# EasyEDA Pro project ProPrj_VFD-CLOCK_2024-10-19.epro, schematic Schematic1

## Sheets
1 VFD: Board Name: Board1; Create Date: 2024-04-14; Page Name: VFD; Project Name: VFD-CLOCK; Schematic Name: Schematic1; Update Date: 2024-10-04; Company: 嘉立创EDA; Page Size: A3; Version: V1.0
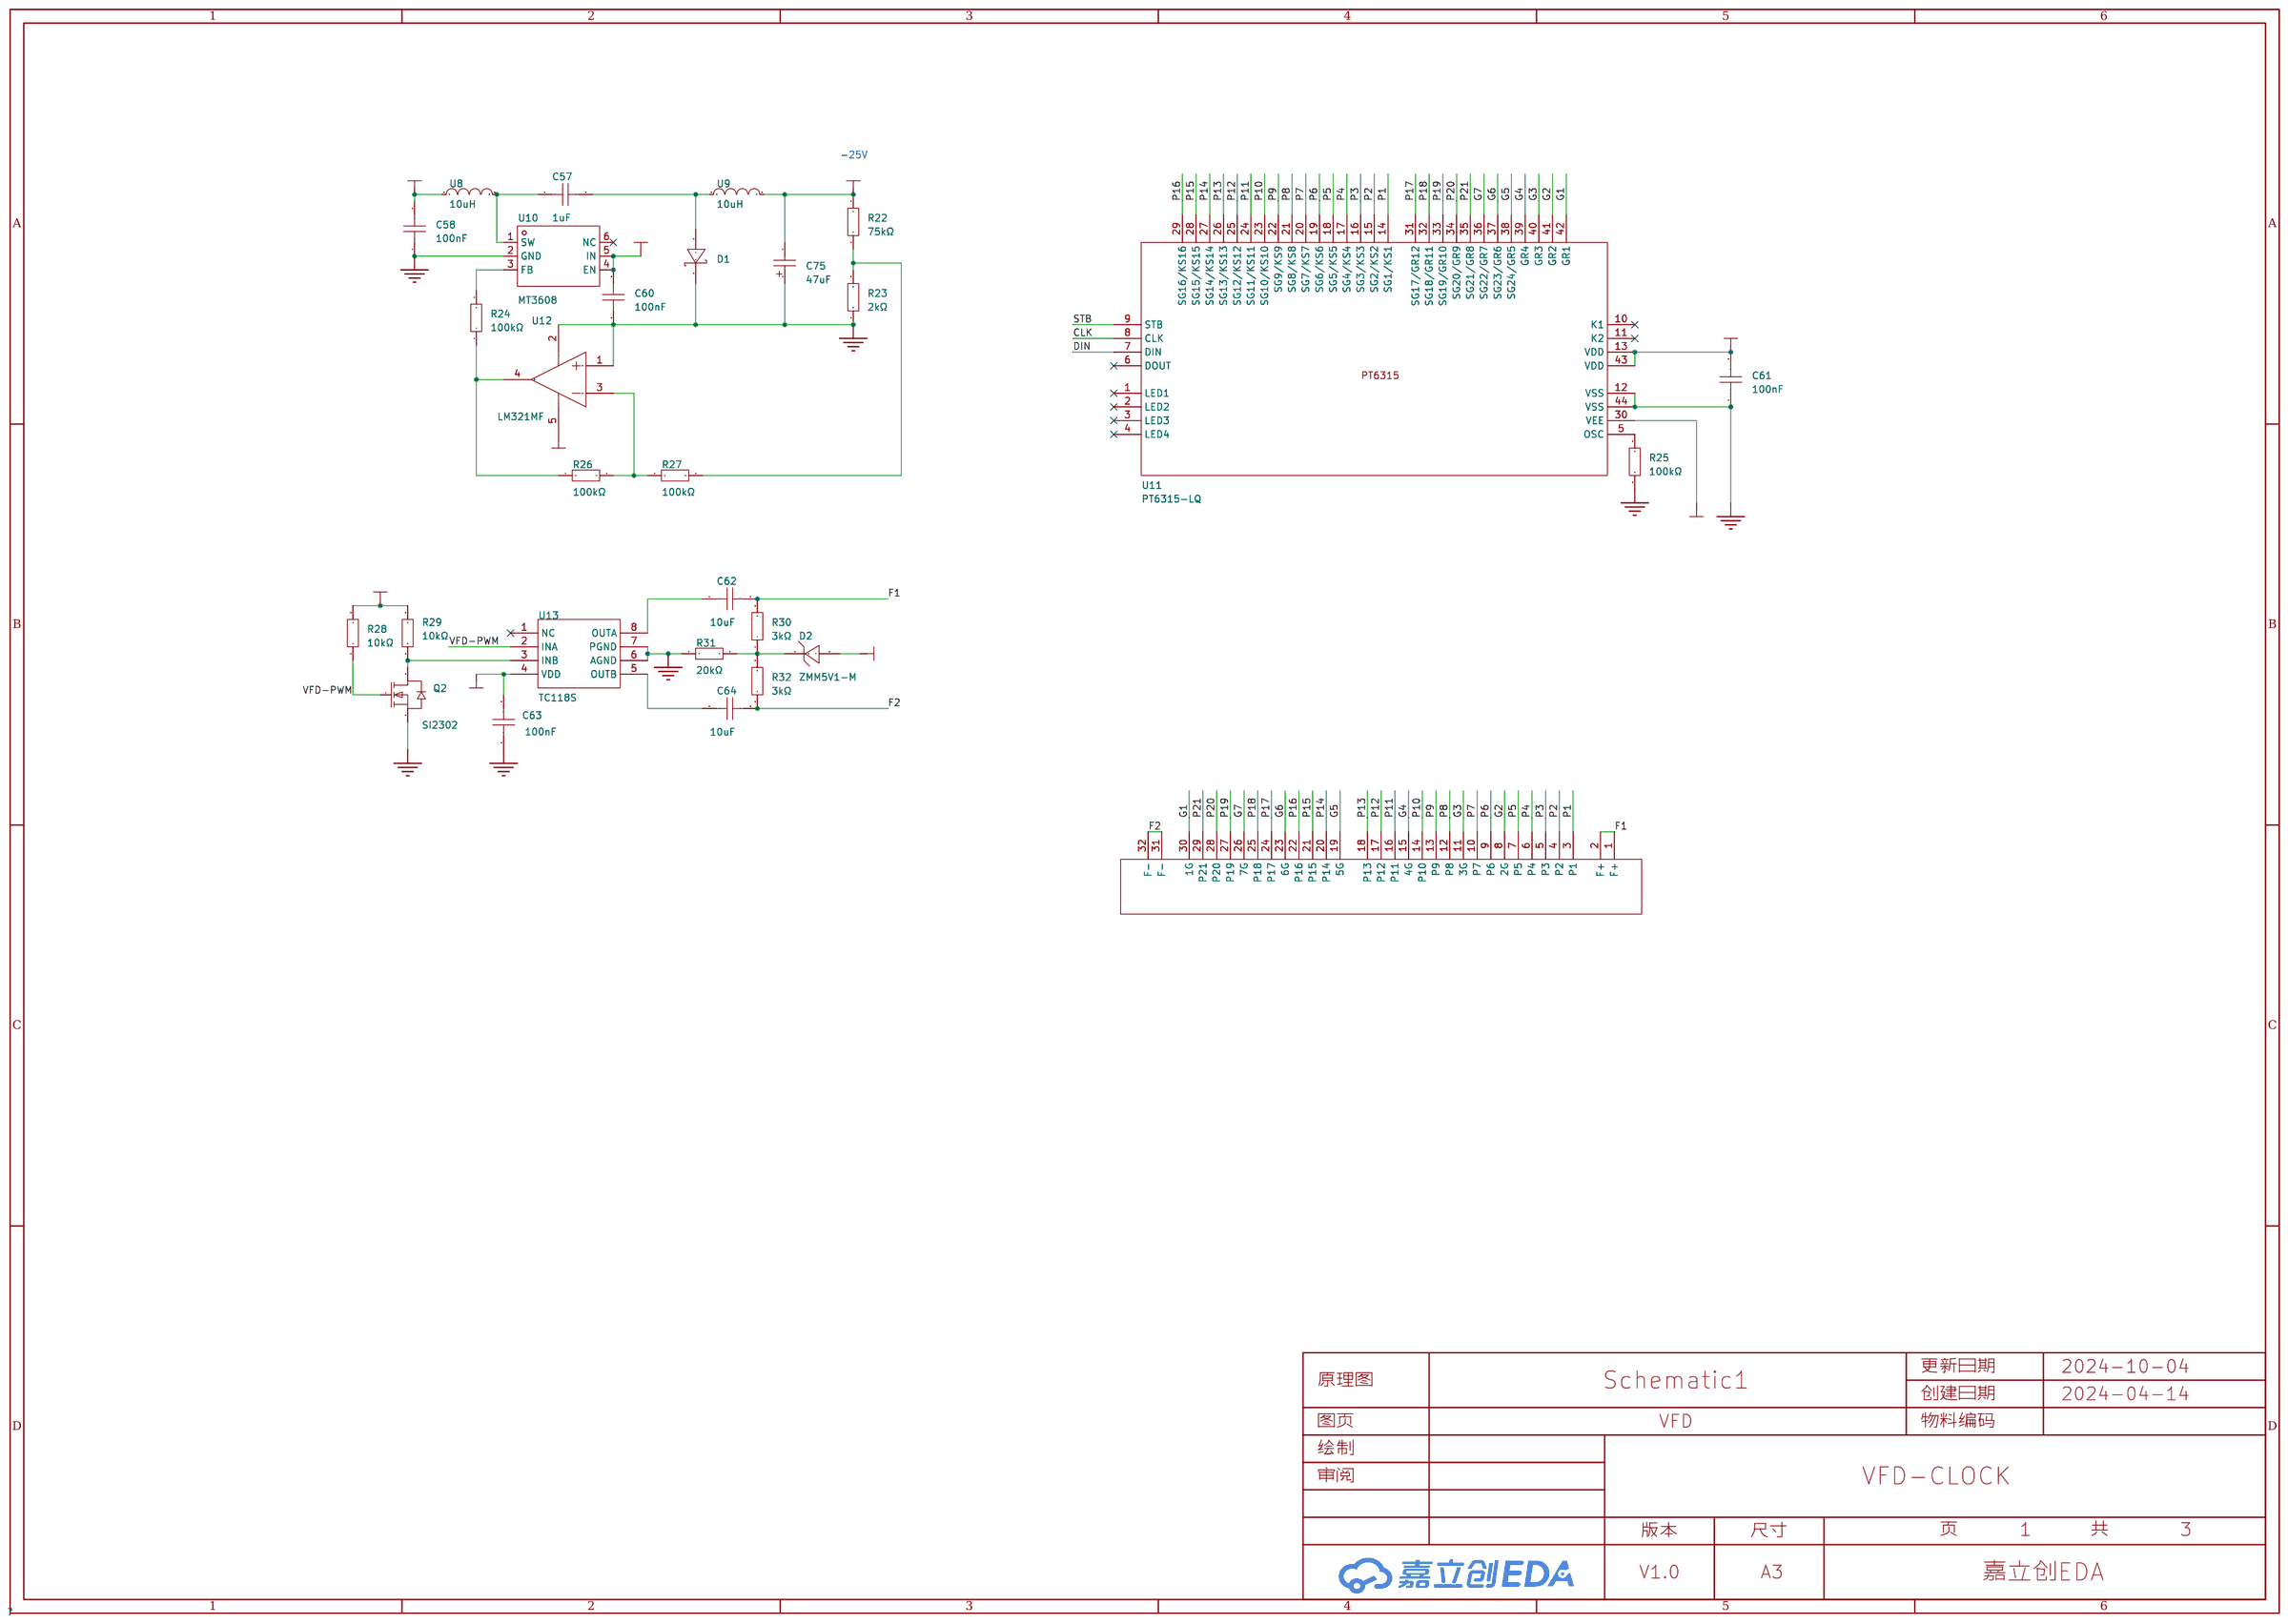
[diagram p1: VFD]
2 MCU: Page Name: MCU; Update Date: 2024-10-16
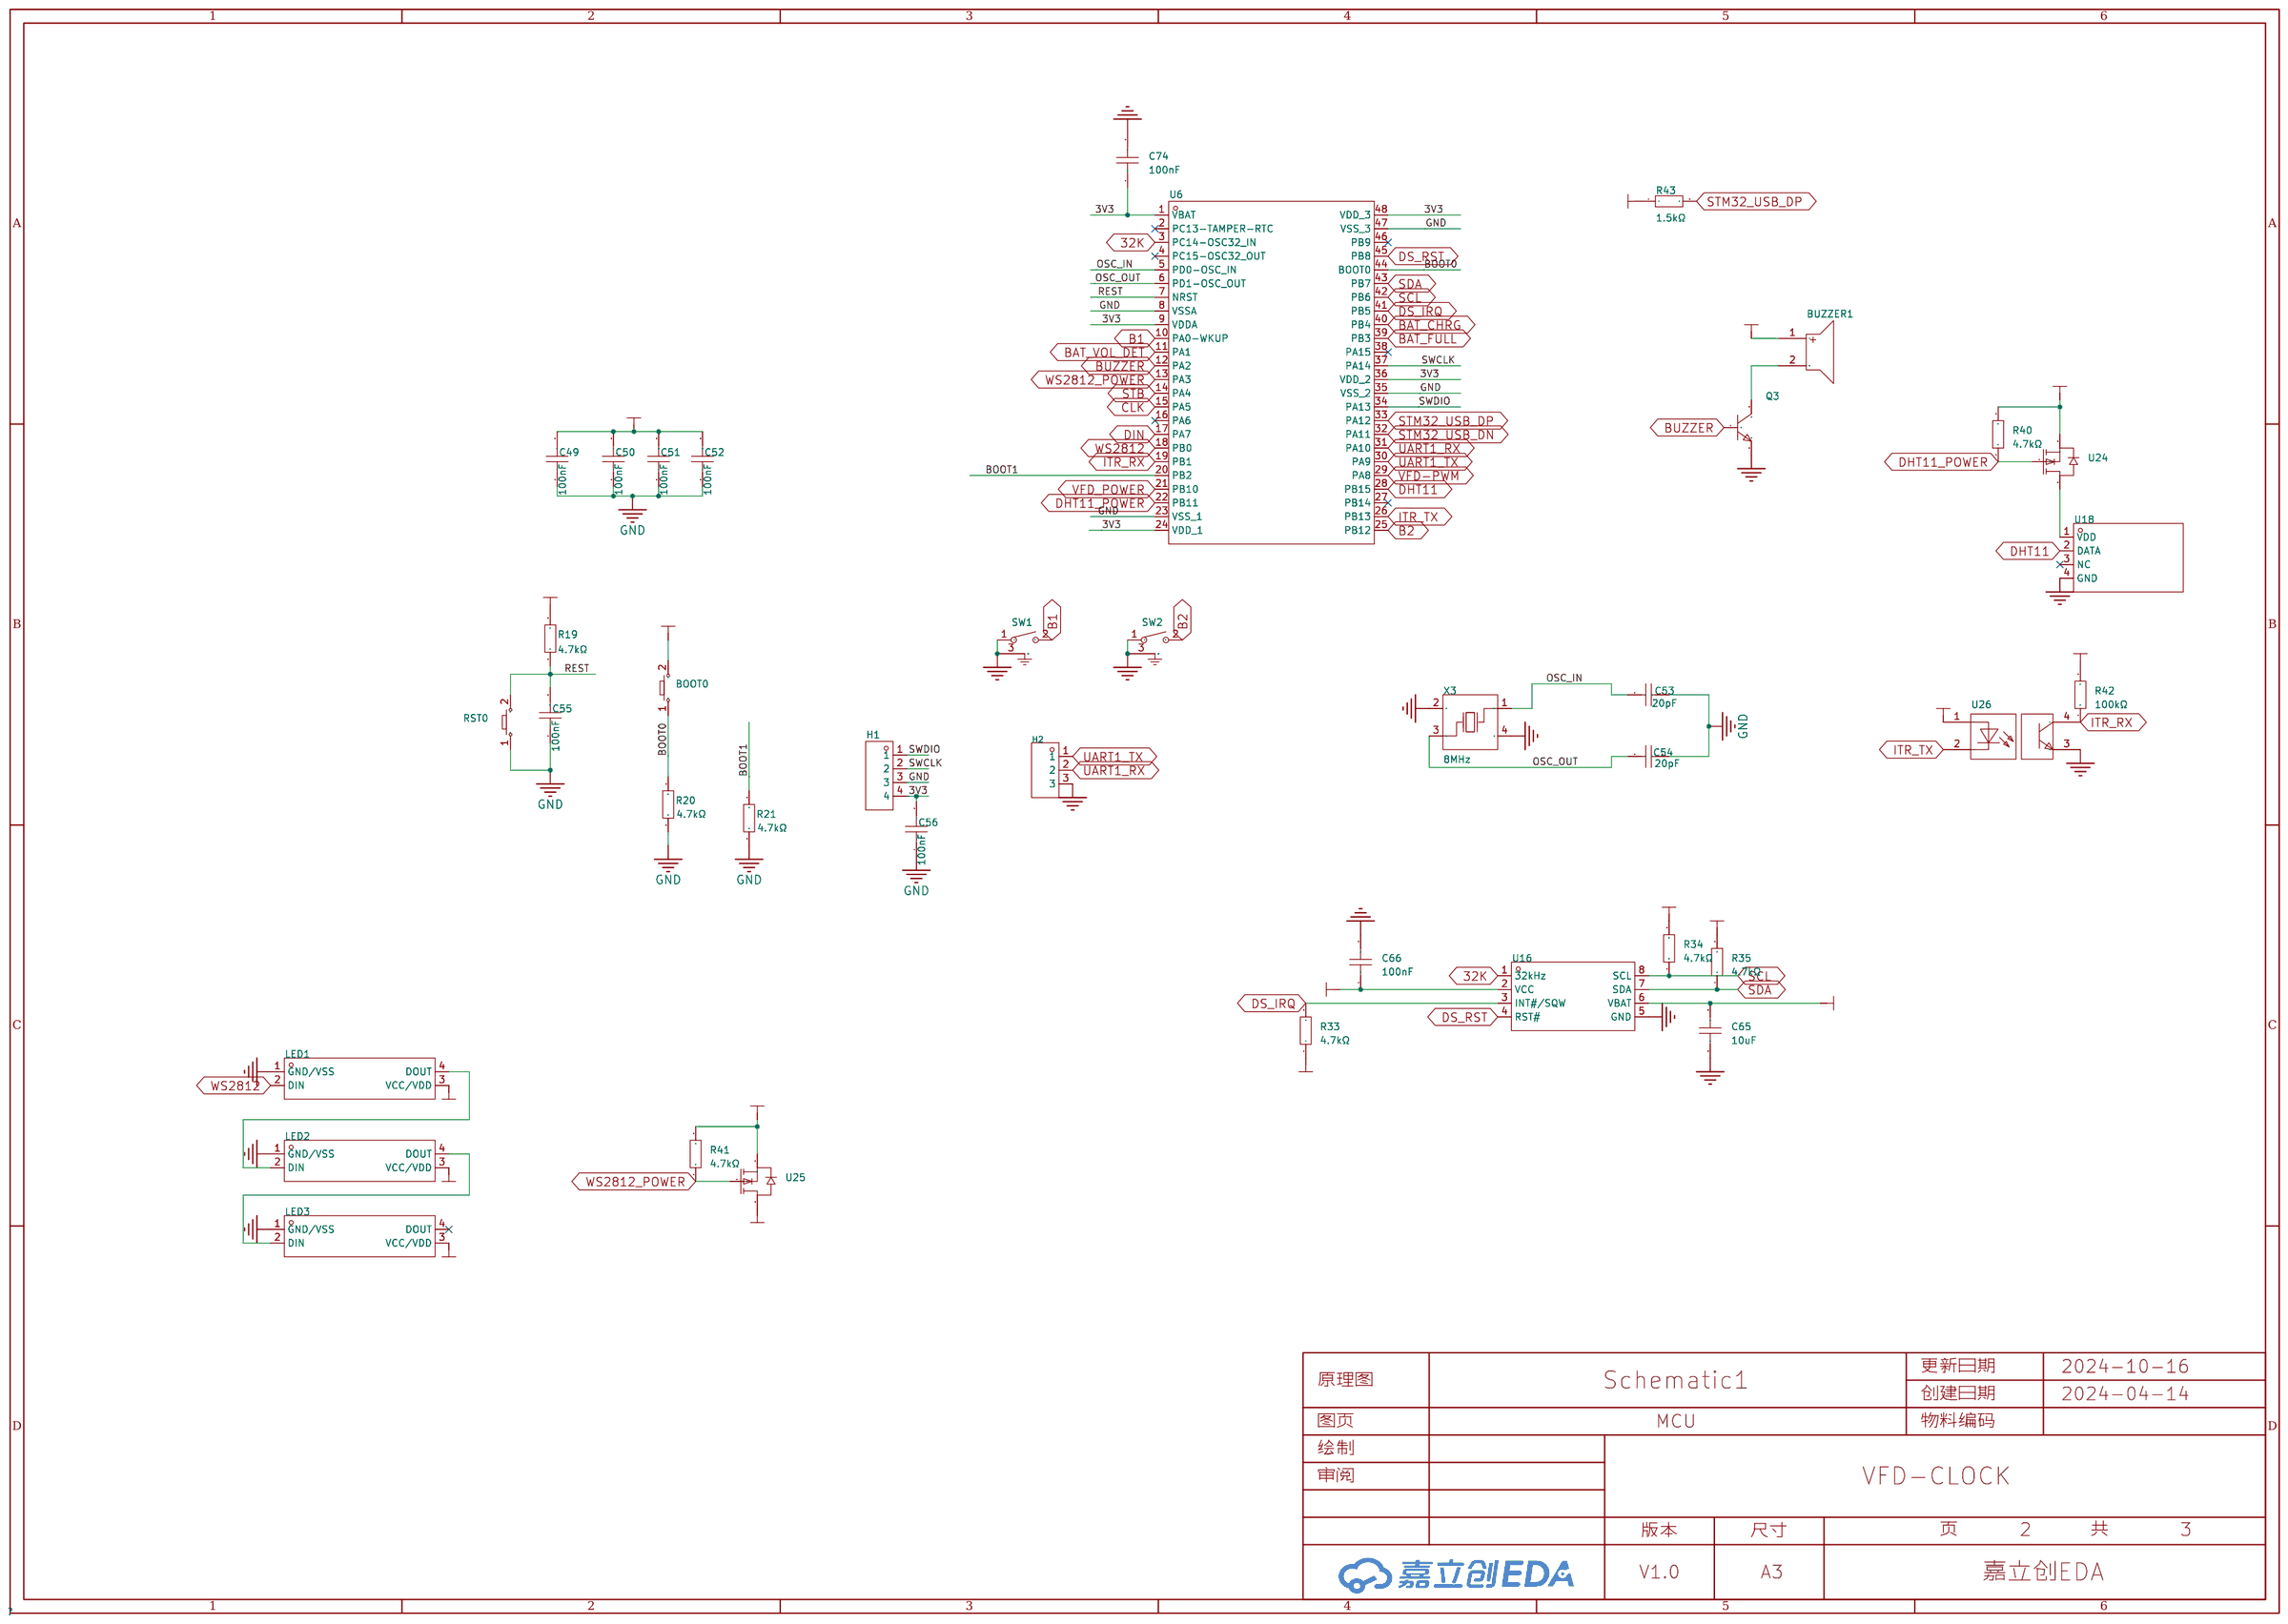
[diagram p2: MCU]
3 POWER: Page Name: POWER; Update Date: 2024-10-16
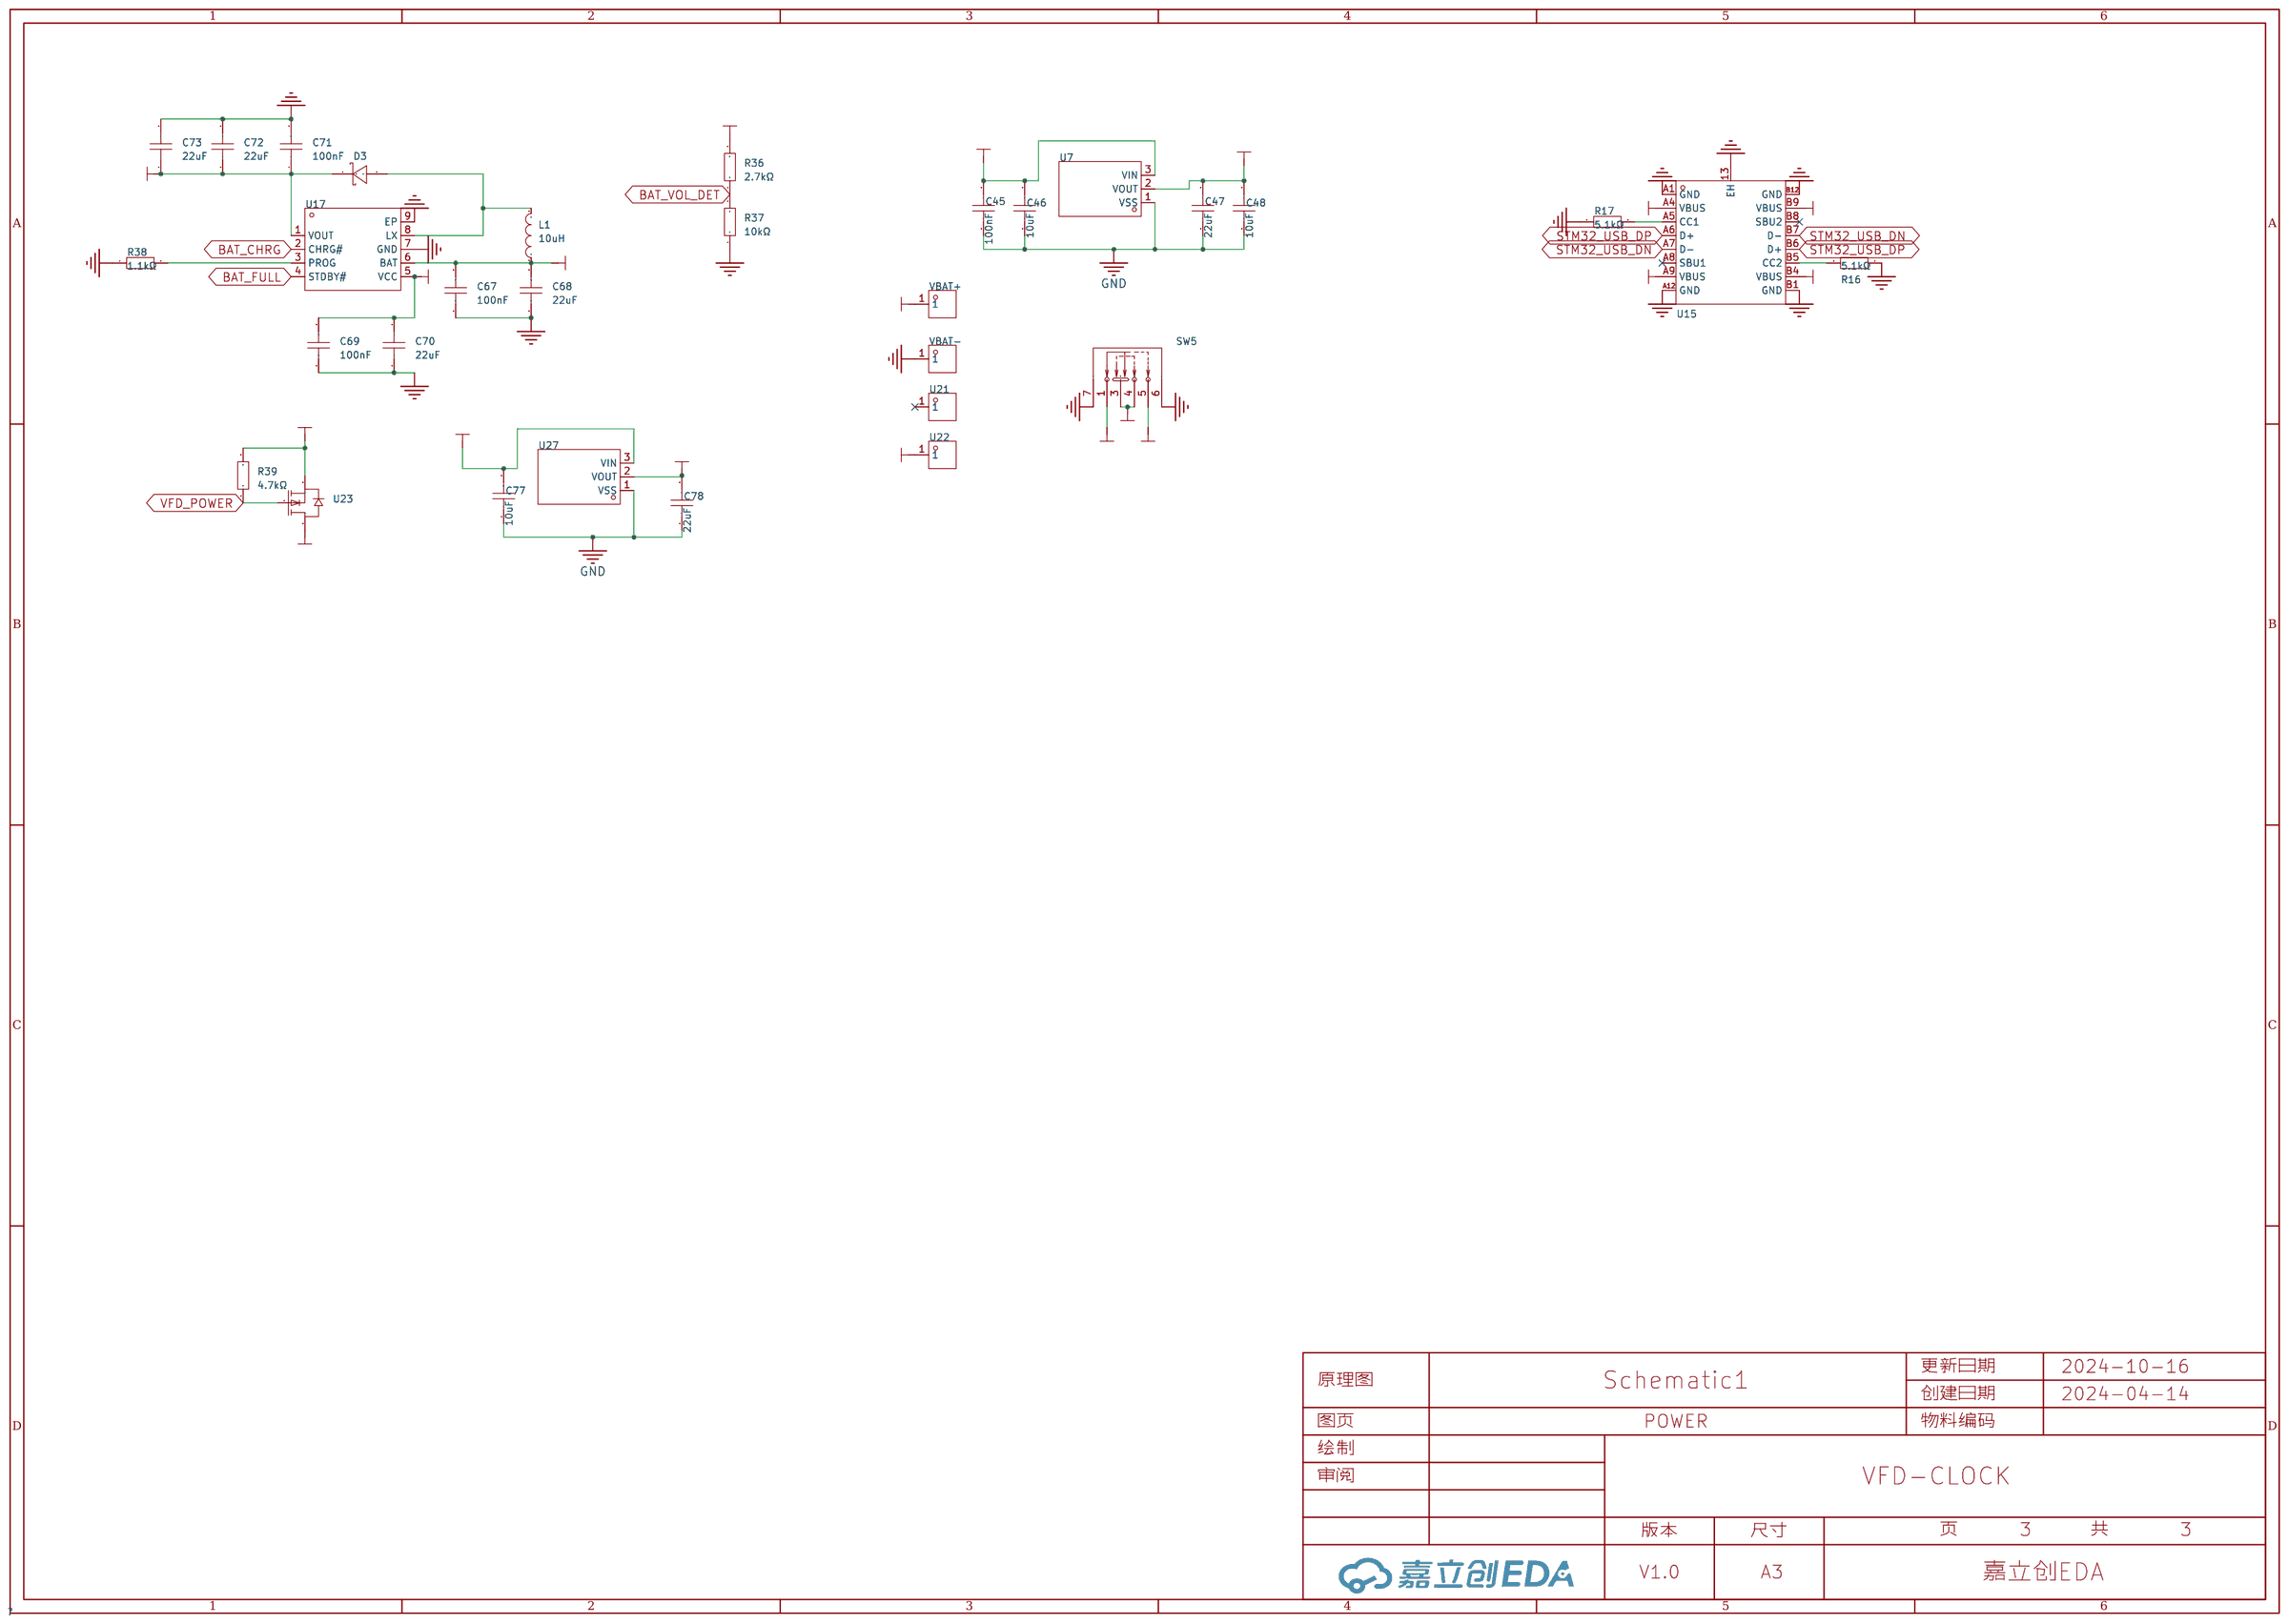
[diagram p3: POWER]

## Parts
sheet MCU
BOOT0  K2-1807SN-A3DW-06  [Key_SMD_3x4x2]
BUZZER1  HX-9042  [BUZ-TH_BD9.0-P4.00-D0.6-FD]
C49  100nF  [C0603]
C50  100nF  [C0603]
C51  100nF  [C0603]
C52  100nF  [C0603]
C53  20pF  [C0603]
C54  20pF  [C0603]
C55  100nF  [C0603]
C56  100nF  [C0603]
C65  10uF  [C0603]
C66  100nF  [C0603]
C74  100nF  [C0603]
H1  -  [HDR-TH_4P-P2.54-V-M]
H2  PZ254V-11-03P  [HDR-TH_3P-P2.54-V-M]
LED1  WS2812B-5050RGB  [LED-SMD_4P-L5.0-W5.0-BR_WS2812B-5050RGB]
LED2  WS2812B-5050RGB  [LED-SMD_4P-L5.0-W5.0-BR_WS2812B-5050RGB]
LED3  WS2812B-5050RGB  [LED-SMD_4P-L5.0-W5.0-BR_WS2812B-5050RGB]
Q3  S8050 J3Y  [SOT-23-3_L3.0-W1.7-P0.95-LS2.9-BR]
R19  4.7kΩ  [R0603]
R20  4.7kΩ  [R0603]
R21  4.7kΩ  [R0603]
R33  4.7kΩ  [R0603]
R34  4.7kΩ  [R0603]
R35  4.7kΩ  [R0603]
R40  4.7kΩ  [R0603]
R41  4.7kΩ  [R0603]
R42  100kΩ  [R0603]
R43  1.5kΩ  [R0603]
RST0  K2-1807SN-A3DW-06  [Key_SMD_3x4x2]
SW1  TS-1038-A10B3-D2  [KEY-TH_TS-1038-A10B3-D2]
SW2  TS-1038-A10B3-D2  [KEY-TH_TS-1038-A10B3-D2]
U6  -  [LQFP-48_L7.0-W7.0-P0.50-LS9.0-BL]
U16  DS3231MZ/V+  [SOIC-8_L4.9-W3.9-P1.27-LS6.0-BL]
U18  DHT11  [SENSOR-TH_DHT11]
U24  AO3401  [SOT-23-3_L2.9-W1.3-P0.95-LS2.4-BR]
U25  AO3401  [SOT-23-3_L2.9-W1.3-P0.95-LS2.4-BR]
U26  ITR20001/T  [OPTO-TH_4P_ITR20001-T-F316]
X3  8MHz  [OSC-SMD_4P-L3.2-W2.5-BL]
sheet POWER
C45  100nF  [C0603]
C46  10uF  [C0603]
C47  22uF  [C0603]
C48  10uF  [C0603]
C67  100nF  [C0603]
C68  22uF  [C0603]
C69  100nF  [C0603]
C70  22uF  [C0603]
C71  100nF  [C0603]
C72  22uF  [C0603]
C73  22uF  [C0603]
C77  10uF  [C0603]
C78  22uF  [C0603]
D3  SS34  [SMA_L4.3-W2.6-LS5.2-RD]
L1  10uH  [IND-SMD_L7.3-W6.6]
R16  5.1kΩ  [R0603]
R17  5.1kΩ  [R0603]
R36  2.7kΩ  [R0603]
R37  10kΩ  [R0603]
R38  1.1kΩ  [R0603]
R39  4.7kΩ  [R0603]
SW5  SK13D07VG4  [SW-TH_SK13D07VG4]
U7  ME6206A33XG  [SOT-23-3_L2.9-W1.6-P1.90-LS2.8-BR]
U15  MC-118LD-H65  [USB-C-TH_HANBO_MC-118LD-H65]
U17  TP5400  [ESOP-8_L4.9-W3.9-P1.27-LS6.0-BL-EP]
U21  M2*10+3六角单通铜  [CONN-TH_C9900012092]
U22  M2*10+3六角单通铜  [CONN-TH_C9900012092]
U23  AO3401  [SOT-23-3_L2.9-W1.3-P0.95-LS2.4-BR]
U27  ME6206A33XG  [SOT-23-3_L2.9-W1.6-P1.90-LS2.8-BR]
VBAT+  M2*10+3六角单通铜  [CONN-TH_C9900012092]
VBAT-  M2*10+3六角单通铜  [CONN-TH_C9900012092]
sheet VFD
C57  1uF  [C0603]
C58  100nF  [C0603]
C60  100nF  [C0603]
C61  100nF  [C0603]
C62  10uF  [C0603]
C63  100nF  [C0603]
C64  10uF  [C0603]
C75  47uF  [C_Ele_SMD_5x5.4mm]
D1  SS34  [SMA_L4.3-W2.6-LS5.2-RD]
D2  ZMM5V1-M  [LL-34_L3.5-W1.5-RD]
Q2  SI2302  [SOT-23-3_L2.9-W1.3-P1.90-LS2.4-BR]
R22  75kΩ  [r0603]
R23  2kΩ  [r0603]
R24  100kΩ  [r0603]
R25  100kΩ  [r0603]
R26  100kΩ  [r0603]
R27  100kΩ  [r0603]
R28  10kΩ  [R0603]
R29  10kΩ  [R0603]
R30  3kΩ  [r0603]
R31  20kΩ  [r0603]
R32  3kΩ  [r0603]
U8  10uH  [IND-SMD_L7.0-W6.6]
U9  10uH  [IND-SMD_L7.0-W6.6]
U10  MT3608  [SOT-23-6_L2.9-W1.6-P0.95-LS2.8-BL]
U11  PT6315-LQ  [LQFP-PT6315]
U12  LM321MF  [SOT-23-5_L2.9-W1.6-P0.95-LS2.8-BR]
U13  TC118S  [SOP-8_L4.9-W3.9-P1.27-LS6.0-BL]
U14  7-BT-317NK  [7-BT-317NK]

## Library data of the parts
BOOT0 RST0 = K2-1807SN-A3DW-06: 作用力:180gf;安装方式:立贴;开关长度:4mm;开关宽度:2.9mm;开关高度:2mm;触点电流:50mA;额定电压(DC):12V;绝缘电阻:100MΩ;机械寿命:10万次;; LCSC Part Name: 3×4×2 160G 2P 无柱 双弹片 防水膜; Supplier Part: C707338; Manufacturer: 韩国韩荣; Supplier Footprint: SMD; JLCPCB Part Class: Extended Part; Datasheet: https://atta.szlcsc.com/upload/public/pdf/source/20210810/47B2303F2A54EA82C8741CE08BEBC5F9.pdf; Supplier: LCSC; Operating Force: 180gf; Mounting Style: 立贴; Switch Length: 4mm; Switch Width: 2.9mm; Switch Height: 2mm; Contact Current: 50mA; Voltage Rating (DC): 12V; Insulation Resistance: 100MΩ; Mechanical Life: 10万次; Operating Temperature: -25℃~+85℃
BUZZER1 = HX-9042: Supplier Part: C9900014398; Supplier Footprint: 9042; JLCPCB Part Class: 扩展库; Supplier: LCSC; Check: true
C45 C47 C49-C52 C55 C56 C78 = CC0603KRX7R9BB104: 容值:100nF;精度:±10%;额定电压:50V;材质(温度系数):X7R;; LCSC Part Name: 100nF ±10% 50V; Supplier Part: C14663; Manufacturer: YAGEO(国巨); Supplier Footprint: 0603; JLCPCB Part Class: Basic Part; Datasheet: https://atta.szlcsc.com/upload/public/pdf/source/20170116/1484561234239.pdf; Supplier: LCSC; Tolerance: ±10%; Voltage Rated: 50V; Temperature Coefficient: X7R
C53 C54 = CL10C200JB8NNNC: 容值:20pF;精度:±5%;额定电压:50V;材质(温度系数):C0G;; LCSC Part Name: 20pF ±5% 50V; Supplier Part: C1648; Manufacturer: SAMSUNG(三星); Supplier Footprint: 0603; JLCPCB Part Class: Basic Part; Datasheet: https://atta.szlcsc.com/upload/public/pdf/source/20160103/1457707686863.pdf; Supplier: LCSC; Tolerance: ±5%; Voltage Rated: 50V; Temperature Coefficient: C0G
C62 C64 C65 = CL10A106KP8NNNC: 容值:10uF;精度:±10%;额定电压:10V;材质(温度系数):X5R;; LCSC Part Name: 10uF ±10% 10V; Supplier Part: C19702; Manufacturer: SAMSUNG(三星); Supplier Footprint: 0603; JLCPCB Part Class: Basic Part; Datasheet: https://atta.szlcsc.com/upload/public/pdf/source/20160218/1457707763339.pdf; Supplier: LCSC; Tolerance: ±10%; Voltage Rated: 10V; Temperature Coefficient: X5R
C58 C60 C61 C63 C66 C67 C69 C71 C74 = CC0603KRX7R9BB104: 容值:100nF;精度:±10%;额定电压:50V;材质(温度系数):X7R;; LCSC Part Name: 100nF ±10% 50V; Supplier Part: C14663; Manufacturer: YAGEO(国巨); Supplier Footprint: 0603; JLCPCB Part Class: Basic Part; Datasheet: https://atta.szlcsc.com/upload/public/pdf/source/20180910/C282072_33301C7F631E79921B82A8DAC6BCC5B3.pdf; Supplier: LCSC; Tolerance: ±10%; Voltage Rated: 50V; Temperature Coefficient: X7R
H1 = PZ254V-11-04P: 间距:2.54mm;总PIN位数:4;排数:1;插针结构:1x4P;行距:-;安装类型:直插;圆针/方针:方针;额定电流:-;额定电压:-;配合针长度:6mm;塑高:2.5mm;端接针长度:3mm;触头材质:黄铜;触头镀层:-;工作温度范围:-40~+105;颜色:黑色;; LCSC Part Name: 2.54mm 1x4P 直插 方针; Supplier Part: C492403; Manufacturer: XFCN(兴飞); Supplier Footprint: 插件,P=2.54mm; JLCPCB Part Class: Extended Part; Datasheet: https://atta.szlcsc.com/upload/public/pdf/source/20200309/C492403_F9F19131791D08044AD4F84F8E751A34.pdf; Supplier: LCSC; Pitch: 2.54mm; Number of Pins: 4; Number of Rows: 1; Pin Structure: 1x4P; Mounting Type: 直插; Circluar Pins/Square Pins: 方针; Length of Mating Pin: 6mm; Insulation Height: 2.5mm; Length of End Connection Pin: 3mm; Contact Material: 黄铜; Operating Temperature Range: -40~+105; Color: 黑色
H2 = PZ254V-11-03P: 插针结构:1x3P;间距:2.54mm;行距:-;圆针/方针:方针;安装类型:直插;排数:单排;总PIN位数:3P;额定电流:3A;额定电压:250V;配合针长度:6mm;塑高:2.5mm;端接针长度:3mm;工作温度范围:-40℃~+105℃;颜色:黑色;; LCSC Part Name: 间距:2.54mm 1x3P 直插 方针; Supplier Part: C2937625; Manufacturer: XFCN(兴飞); Supplier Footprint: 插件,P=2.54mm; JLCPCB Part Class: 扩展库; Datasheet: https://atta.szlcsc.com/upload/public/pdf/source/20200309/C492402_8335C3D49C4E4C618838D59BB1D024C1.pdf; Supplier: LCSC; Pin Structure: 1x3P; Pitch: 2.54mm; Circluar Pins/Square Pins: 方针; Mounting Type: 直插; Number of Rows: 单排; Number of Pins: 3P; Current Rating (Max): 3A; Voltage Rating (Max): 250V; Length of Mating Pin: 6mm; Insulation Height: 2.5mm; Length of End Connection Pin: 3mm; Operating Temperature Range: -40℃~+105℃; Color: 黑色
LED1-LED3 = WS2812B-5050RGB: Supplier Part: C2838584; Supplier Footprint: SMD-4_5.0X5.0X4.2P; JLCPCB Part Class: 扩展库; Supplier: LCSC
Q3 = S8050 J3Y_C2146: 晶体管类型:NPN;集电极电流(Ic):500mA;集射极击穿电压(Vceo):25V;功率(Pd):300mW;直流电流增益(hFE@Ic,Vce):200@50mA,1V;; LCSC Part Name: S8050 J3Y(RANGE:200-350) H档(200-350); Supplier Part: C2146; Manufacturer: CJ(江苏长电/长晶); Supplier Footprint: SOT-23; JLCPCB Part Class: 基础库; Datasheet: https://atta.szlcsc.com/upload/public/pdf/source/20140809/1457707209234.pdf; Supplier: LCSC; Transistor Type: NPN; Collector Current (Ic): 500mA; Collector-Emitter Breakdown Voltage (Vceo): 25V; Power Dissipation (Pd): 300mW; DC Current Gain (hFE@Ic,Vce): 200@50mA,1V; Transition Frequency (fT): 150MHz; Collector Cut-Off Current (Icbo): 100nA; Collector-Emitter Saturation Voltage (VCE(sat)@Ic,Ib): 600mV@500mA,50mA
R19-R21 R33-R35 = 0603WAF4701T5E: 电阻类型:厚膜电阻;阻值:4.7kΩ;精度:±1%;功率:100mW;最大工作电压:75V;温度系数:±100ppm/℃;; LCSC Part Name: 4.7kΩ ±1% 100mW 厚膜电阻; Supplier Part: C23162; Manufacturer: UNI-ROYAL(厚声); Supplier Footprint: 0603; JLCPCB Part Class: Basic Part; Datasheet: https://atta.szlcsc.com/upload/public/pdf/source/20200306/C422600_1E6D84923E4A46A82E41ADD87F860B5C.pdf; Supplier: LCSC; Type: 厚膜电阻; Tolerance: ±1%; Power(Watts): 100mW; Overload Voltage (Max): 75V; Temperature Coefficient: ±100ppm/℃; Operating Temperature Range: -55℃~+155℃
R28 R29 R37 R39-R41 = 0603WAF1002T5E: 电阻类型:厚膜电阻;阻值:10kΩ;精度:±1%;功率:100mW;最大工作电压:75V;温度系数:±100ppm/℃;; LCSC Part Name: 厚膜电阻 10kΩ ±1% 100mW; Supplier Part: C25804; Manufacturer: UNI-ROYAL(厚声); Supplier Footprint: 0603; JLCPCB Part Class: Basic Part; Datasheet: https://atta.szlcsc.com/upload/public/pdf/source/20200306/C422600_1E6D84923E4A46A82E41ADD87F860B5C.pdf; Supplier: LCSC; Type: 厚膜电阻; Tolerance: ±1%; Power(Watts): 100mW; Overload Voltage (Max): 75V; Temperature Coefficient: ±100ppm/℃; Operating Temperature Range: -55℃~+155℃
R24-R27 R42 = 0603WAF1003T5E: 电阻类型:厚膜电阻;阻值:100kΩ;精度:±1%;功率:100mW;最大工作电压:75V;温度系数:±100ppm/℃;; LCSC Part Name: 100kΩ ±1% 100mW 厚膜电阻; Supplier Part: C25803; Manufacturer: UNI-ROYAL(厚声); Supplier Footprint: 0603; JLCPCB Part Class: Basic Part; Datasheet: https://atta.szlcsc.com/upload/public/pdf/source/20200306/C422600_1E6D84923E4A46A82E41ADD87F860B5C.pdf; Supplier: LCSC; Type: 厚膜电阻; Tolerance: ±1%; Power(Watts): 100mW; Overload Voltage (Max): 75V; Temperature Coefficient: ±100ppm/℃; Operating Temperature Range: -55℃~+155℃
R43 = Res_0603: Supplier Footprint: 0603
SW1 SW2 = TS-1038-A10B3-D2: 电路结构:单刀单掷;按钮形状:圆形按钮;作用力:250gf;安装方式:卧插;开关高度:8.5mm;带支架:带支架;机械寿命:-;; LCSC Part Name: 轻触开关6*6*8.5插件带支架按键四脚侧按250gf; Supplier Part: C499341; Manufacturer: Yuandi(元迪); Supplier Footprint: 插件; JLCPCB Part Class: 扩展库; Datasheet: https://atta.szlcsc.com/upload/public/pdf/source/20200318/C499335_4B4A7BCFD69E5F6CF6B720C838D8CF83.pdf; Supplier: LCSC; Circuit: 单刀单掷; Actuator Style: 圆形按钮; Operating Force: 250gf; Mounting Style: 卧插; Switch Height: 8.5mm; Strike Gundam: 带支架; Actuator/Cap Color: 黑色; Pin Style: PC引脚
U6 = STM32F103C8T6: CPU位数:32-Bit;ROM类型:FLASH;CPU内核:ARM® Cortex®-M3;主频（MAX):72MHz;工作电压:2V ~ 3.6V;; LCSC Part Name: STM32F103C8T6 MSL=3; Supplier Part: C8734; Manufacturer: ST(意法半导体); Supplier Footprint: LQFP-48_7x7x05P; JLCPCB Part Class: Basic Part; Datasheet: https://atta.szlcsc.com/upload/public/pdf/source/20140724/1457707174202.pdf; Supplier: LCSC; Core Size: 32-Bit; Program Memory Type: FLASH; Core Processor: ARM® Cortex®-M3; Speed: 72MHz; Voltage - Supply (Vcc/Vdd): 2V ~ 3.6V; Program Memory Size: 64KB; RAM Size: 20KB; Number of I/O: 37; A/D: 10x12bit; D/A: 0; PWM: 13; LCD: 0; UART/USART: 3 USART; SPI: 2; I2C（SMBUS/PMBUS）: 2; USB Device: 1; CAN: 1; Ethernet: 0
U16 = DS3231MZ/V+: 接口:I2C;; Supplier Part: C3304431; Manufacturer: ADI(亚德诺)/MAXIM(美信); Supplier Footprint: SOIC-8; JLCPCB Part Class: 扩展库; Datasheet: https://atta.szlcsc.com/upload/public/pdf/source/20170620/1497944726830.pdf; Supplier: LCSC; Interface: I2C; Operating Voltage: 2.3V~5.5V; Operating Temperature: -40℃~+85℃
U18 = DHT11: 新款电容式数字温湿度传感器,老款已停产16.1x12.6x5.8mm; LCSC Part Name: DHT11  电容式传感器; Supplier Part: C117051; Manufacturer: 广州奥松; Supplier Footprint: SIP-4; JLCPCB Part Class: 扩展库; Datasheet: https://atta.szlcsc.com/upload/public/pdf/source/20170703/1499081238365.pdf; Supplier: LCSC
U23-U25 = AO3401_C5299438: Supplier Part: C5299438; Manufacturer: DOWO(东沃); Supplier Footprint: SOT-23; JLCPCB Part Class: 扩展库; Datasheet: https://atta.szlcsc.com/upload/public/pdf/source/20230921/ED7DEAEFE7908930CD835A6C8952C5E1.pdf; Supplier: LCSC
U26 = ITR20001/T: 感应距离:5mm;集电极电流(最大值):20mA;; Supplier Part: C264269; Manufacturer: EVERLIGHT(亿光); Supplier Footprint: DIP-4; JLCPCB Part Class: 扩展库; Datasheet: https://atta.szlcsc.com/upload/public/pdf/source/20180817/C264269_4256B5400489B2A8B2B17FEF85C63C6F.pdf; Supplier: LCSC; Sensing Distance: 5mm; Collector Current (Max): 20mA
X3 = TAXM8M4RDBCCT2T: 晶振类型:贴片晶振;频率:8MHz;常温频差:±10ppm;外接负载电容:10pF;频率稳定度(全温):±15ppm;; LCSC Part Name: 8MHz ±10ppm 10pF; Supplier Part: C400090; Manufacturer: YJX(雅晶鑫); Supplier Footprint: SMD3225-4P; JLCPCB Part Class: Extended Part; Datasheet: https://atta.szlcsc.com/upload/public/pdf/source/20190626/C400090_CF95B89E745AFE4EF2E392EF8AC009D6.pdf; Supplier: LCSC; Crystal Type: 贴片晶振; Normal temperature Frequency Tolerance: ±10ppm; External load capacitor: 10pF; Frequency Stability(Full temperature range): ±15ppm; Equivalent Series Resistance (ESR): 250Ω; Operating Temperature: -40℃~+85℃
C46 C48 C77 = CL10A106KP8NNNC: 容值:10uF;精度:±10%;额定电压:10V;材质(温度系数):X5R;; LCSC Part Name: 10uF ±10% 10V; Supplier Part: C19702; Manufacturer: SAMSUNG(三星); Supplier Footprint: 0603; JLCPCB Part Class: Basic Part; Datasheet: https://atta.szlcsc.com/upload/public/pdf/source/20160103/1457707703378.pdf; Supplier: LCSC; Tolerance: ±10%; Voltage Rated: 10V; Temperature Coefficient: X5R
C68 C70 C72 C73 = CGA0603X5R226M160JT: 容值:22uF;精度:±20%;额定电压:16V;材质(温度系数):X5R;; LCSC Part Name: 22uF ±20% 16V; Supplier Part: C6119868; Manufacturer: HRE(芯声); Supplier Footprint: 0603; JLCPCB Part Class: Extended Part; Supplier: LCSC; Tolerance: ±20%; Voltage Rated: 16V; Temperature Coefficient: X5R
D1 D3 = SS34_C8678: 二极管配置:独立式;正向压降(Vf):550mV@3A;直流反向耐压(Vr):40V;整流电流:3A;; LCSC Part Name: 电压:40V 电流:3A; Supplier Part: C8678; Manufacturer: MDD(辰达半导体); Supplier Footprint: SMA(DO-214AC); JLCPCB Part Class: Basic Part; Datasheet: https://atta.szlcsc.com/upload/public/pdf/source/20230314/A80AE34493C69B89E2F4B1712F433538.pdf; Supplier: LCSC; Diode Configuration: 独立式; Forward Voltage (Vf@If): 550mV@3A; Reverse Voltage (Vr): 40V; Average Rectified Current (Io): 3A; Reverse Leakage Current (Ir): 500uA@40V; Rectified Current: 3A
L1 = MCS0630-100MPY1: 电感值:10uH;精度:±20%;额定电流:4A;饱和电流(Isat):5.5A;; LCSC Part Name: 10uH ±20% 5.5A; Supplier Part: C2937094; Manufacturer: PSA(信昌电陶); Supplier Footprint: 0630; JLCPCB Part Class: 扩展库; Datasheet: https://atta.szlcsc.com/upload/public/pdf/source/20220121/EA6E6E6F70ED7BAE67EC293805EAAACB.pdf; Supplier: LCSC; Tolerance: ±20%; Rated Current: 4A; Saturation Current (Isat): 5.5A; DC Resistance (DCR): 62mΩ
R16 R17 = 0603WAF5101T5E: 电阻类型:厚膜电阻;阻值:5.1kΩ;精度:±1%;功率:100mW;最大工作电压:75V;温度系数:±100ppm/℃;; LCSC Part Name: 5.1kΩ ±1% 100mW 厚膜电阻; Supplier Part: C23186; Manufacturer: UNI-ROYAL(厚声); Supplier Footprint: 0603; JLCPCB Part Class: Basic Part; Datasheet: https://atta.szlcsc.com/upload/public/pdf/source/20200306/C422600_1E6D84923E4A46A82E41ADD87F860B5C.pdf; Supplier: LCSC; Type: 厚膜电阻; Tolerance: ±1%; Power(Watts): 100mW; Overload Voltage (Max): 75V; Temperature Coefficient: ±100ppm/℃; Operating Temperature Range: -55℃~+155℃
R36 = 0603WAF2701T5E: 电阻类型:厚膜电阻;阻值:2.7kΩ;精度:±1%;功率:100mW;最大工作电压:75V;温度系数:±100ppm/℃;; LCSC Part Name: 2.7kΩ ±1% 100mW 厚膜电阻; Supplier Part: C13167; Manufacturer: UNI-ROYAL(厚声); Supplier Footprint: 0603; JLCPCB Part Class: Basic Part; Datasheet: https://atta.szlcsc.com/upload/public/pdf/source/20200306/C422600_1E6D84923E4A46A82E41ADD87F860B5C.pdf; Supplier: LCSC; Type: 厚膜电阻; Tolerance: ±1%; Power(Watts): 100mW; Overload Voltage (Max): 75V; Temperature Coefficient: ±100ppm/℃; Operating Temperature Range: -55℃~+155℃
R38 = 0603WAF1101T5E: 电阻类型:厚膜电阻;阻值:1.1kΩ;精度:±1%;功率:100mW;最大工作电压:75V;温度系数:±100ppm/℃;; LCSC Part Name: 1.1kΩ ±1% 100mW 厚膜电阻; Supplier Part: C22764; Manufacturer: UNI-ROYAL(厚声); Supplier Footprint: 0603; JLCPCB Part Class: Extended Part; Datasheet: https://atta.szlcsc.com/upload/public/pdf/source/20200306/C422600_1E6D84923E4A46A82E41ADD87F860B5C.pdf; Supplier: LCSC; Type: 厚膜电阻; Tolerance: ±1%; Power(Watts): 100mW; Overload Voltage (Max): 75V; Temperature Coefficient: ±100ppm/℃; Operating Temperature Range: -55℃~+155℃
SW5 = SK13D07VG4: 电路结构:单刀三掷;安装方式:侧插;开关颜色:-;额定电流(DC):300mA;额定电压(DC):50V;额定电流(AC):-;额定电压(AC):-;机械寿命:5千次;; LCSC Part Name: 4脚3三档位SK13D07VG2 1P3T卧式拨动开关,柄长4MM; Supplier Part: C2681581; Manufacturer: SHOU HAN(首韩); Supplier Footprint: 插件; JLCPCB Part Class: 扩展库; Datasheet: https://atta.szlcsc.com/upload/public/pdf/source/20210224/C2681581_976B40BF7B723A53FF2B4716D1A8276E.pdf; Supplier: LCSC; Circuit: 单刀三掷; Pin Style: PC引脚; Switch Length: 12.6mm; Switch Width: 4.4mm; Switch Height: 4.7mm; Mounting Style: 侧插; Current Rating (DC): 300mA; Voltage Rating (DC): 50V; Mechanical Life: 5千次; Operating Temperature: -10℃~+50℃
U7 U27 = ME6206A33XG: 输出类型:固定;输出极性:正;最大输入电压:6V;输出电压:3.3V;输出电流:300mA;电源纹波抑制比(PSRR):50dB@(1kHz);; LCSC Part Name: 输入6V 输出3.3V 300mA; Supplier Part: C161345; Manufacturer: MICRONE(南京微盟); Supplier Footprint: SOT-23; JLCPCB Part Class: 扩展库; Datasheet: https://atta.szlcsc.com/upload/public/pdf/source/20180207/C161345_15179949863651359188.pdf; Supplier: LCSC; Output Type: 固定; Output Polarity: 正; Number of Outputs: 1; Maximum Input Voltage: 6V; Output Voltage: 3.3V; Dropout Voltage: 400mV@(200mA); Output Current: 300mA; Power Supply Rejection Ratio (PSRR): 50dB@(1kHz)
U15 = MC-118LD-H65: 连接器类型:Type-C;标准:USB 3.1;公母:母;端口数量:1;触点数量:16P;安装方式:直插;额定电流 - 电源:5A;工作温度范围:-55℃~+85℃;焊接温度(最大值):260℃;; LCSC Part Name: Type-C 母 直插; Supplier Part: C6332304; Manufacturer: HANBO(汉博); Supplier Footprint: 插件; JLCPCB Part Class: 扩展库; Datasheet: https://atta.szlcsc.com/upload/public/pdf/source/20230512/493F86F6440C2CBC9B0BB9A42FADB62F.pdf; Supplier: LCSC; Connector Type: Type-C; Standard: USB 3.1; Gender: 母; Number of Ports: 1; Number of Contacts: 16P; Mounting Style: 直插; Current Rating - Power (Max): 5A; Operating Temperature Range: -55℃~+85℃; Soldering Temperature(Max): 260℃
U17 = TP5400: Supplier Part: C2891434; Manufacturer: TOPPOWER(南京拓微); Supplier Footprint: ESOP-8; JLCPCB Part Class: 扩展库; Datasheet: https://atta.szlcsc.com/upload/public/pdf/source/20210909/352D9D40D77A1DD73F7904E364EF004B.pdf; Supplier: LCSC
U21 U22 VBAT+ VBAT- = M2*10+3六角单通铜: Supplier Part: C9900012092; JLCPCB Part Class: 扩展库; Supplier: LCSC
C57 = CL10A105KB8NNNC: 容值:1uF;精度:±10%;额定电压:50V;材质(温度系数):X5R;; LCSC Part Name: 1uF ±10% 50V; Supplier Part: C15849; Manufacturer: SAMSUNG(三星); Supplier Footprint: 0603; JLCPCB Part Class: Basic Part; Datasheet: https://atta.szlcsc.com/upload/public/pdf/source/20160218/1457707763339.pdf; Supplier: LCSC; Tolerance: ±10%; Voltage Rated: 50V; Temperature Coefficient: X5R
C75 = RST47UF25V035: 容值:47uF;精度:±20%;额定电压:25V;纹波电流:46mA@120Hz;等效串联电阻:-;; LCSC Part Name: 47uF ±20% 25V; Supplier Part: C4747958; Manufacturer: KNSCHA(科尼盛); Supplier Footprint: SMD,D5xL5.4mm; JLCPCB Part Class: Extended Part; Datasheet: https://atta.szlcsc.com/upload/public/pdf/source/20220722/F8BC83B31678FEDC3CD0A31DD9384B2B.pdf; Supplier: LCSC; Tolerance: ±20%; Rated Voltage: 25V; Ripple Current: 46mA@120Hz; φD: 5mm; L: 5.4mm; Lifetime @ Temp: 2000hrs@105℃; Operating Temperature: -40℃~+105℃
D2 = ZMM5V1-M: 二极管配置:独立式;稳压值(标称值):5.1V;稳压值(范围):4.8V~5.4V;精度:-;功率:500mW;反向电流(Ir):100nA@1V;阻抗(Zzt):35Ω;; LCSC Part Name: 5.1V 500mW; Supplier Part: C8061; Manufacturer: ST(先科); Supplier Footprint: LL-34; JLCPCB Part Class: 扩展库; Datasheet: https://atta.szlcsc.com/upload/public/pdf/source/20120512/1457706507535.pdf; Supplier: LCSC; Diode Configuration: 独立式; Zener Voltage (Nom): 5.1V; Zener Voltage (Range): 4.8V~5.4V; Power Dissipation: 500mW; Reverse Leakage Current (Ir): 100nA@1V; Zener Impedance (Zzt): 35Ω
Q2 = SI2302: 类型:N沟道;漏源电压(Vdss):20V;连续漏极电流(Id):2.6A;功率(Pd):900mW;导通电阻(RDS(on)@Vgs,Id):85mΩ@4.5V,2.6A;阈值电压(Vgs(th)@Id):1.5V@250uA;栅极电荷(Qg@Vgs):-;输入电容(Ciss@Vds):880pF@6V;反向传输电容(Crss@Vds):-;工作温度:+150℃@(Tj);; LCSC Part Name: N沟道 20V 2.6A; Supplier Part: C2841377; Manufacturer: TECH PUBLIC(台舟); Supplier Footprint: SOT-23-3; JLCPCB Part Class: 扩展库; Datasheet: https://atta.szlcsc.com/upload/public/pdf/source/20210810/B45106B571BB908B9120BCB1C1283335.pdf; Supplier: LCSC; Type: N沟道; Drain Source Voltage (Vdss): 20V; Continuous Drain Current (Id): 2.6A; Power Dissipation (Pd): 900mW; Drain Source On Resistance (RDS(on)@Vgs,Id): 85mΩ@4.5V,2.6A; Gate Threshold Voltage (Vgs(th)@Id): 1.5V@250uA; Input Capacitance (Ciss@Vds): 880pF@6V; Operating Temperature: +150℃@(Tj)
R22 = 0603WAF7502T5E: 电阻类型:厚膜电阻;阻值:75kΩ;精度:±1%;功率:100mW;最大工作电压:75V;温度系数:±100ppm/℃;; LCSC Part Name: 75kΩ ±1% 100mW 厚膜电阻; Supplier Part: C23242; Manufacturer: UNI-ROYAL(厚声); Supplier Footprint: 0603; JLCPCB Part Class: Basic Part; Datasheet: https://atta.szlcsc.com/upload/public/pdf/source/20200306/C422600_1E6D84923E4A46A82E41ADD87F860B5C.pdf; Supplier: LCSC; Type: 厚膜电阻; Tolerance: ±1%; Power(Watts): 100mW; Overload Voltage (Max): 75V; Temperature Coefficient: ±100ppm/℃; Operating Temperature Range: -55℃~+155℃
R23 = 0603WAF2001T5E: 电阻类型:厚膜电阻;阻值:2kΩ;精度:±1%;功率:100mW;最大工作电压:75V;温度系数:±100ppm/℃;; LCSC Part Name: 2kΩ ±1% 100mW 厚膜电阻; Supplier Part: C22975; Manufacturer: UNI-ROYAL(厚声); Supplier Footprint: 0603; JLCPCB Part Class: Basic Part; Datasheet: https://atta.szlcsc.com/upload/public/pdf/source/20200306/C422600_1E6D84923E4A46A82E41ADD87F860B5C.pdf; Supplier: LCSC; Type: 厚膜电阻; Tolerance: ±1%; Power(Watts): 100mW; Overload Voltage (Max): 75V; Temperature Coefficient: ±100ppm/℃; Operating Temperature Range: -55℃~+155℃
R30 R32 = 0603WAF3001T5E: 电阻类型:厚膜电阻;阻值:3kΩ;精度:±1%;功率:100mW;最大工作电压:75V;温度系数:±100ppm/℃;; LCSC Part Name: 3kΩ ±1% 100mW 厚膜电阻; Supplier Part: C4211; Manufacturer: UNI-ROYAL(厚声); Supplier Footprint: 0603; JLCPCB Part Class: Basic Part; Datasheet: https://atta.szlcsc.com/upload/public/pdf/source/20200306/C422600_1E6D84923E4A46A82E41ADD87F860B5C.pdf; Supplier: LCSC; Type: 厚膜电阻; Tolerance: ±1%; Power(Watts): 100mW; Overload Voltage (Max): 75V; Temperature Coefficient: ±100ppm/℃; Operating Temperature Range: -55℃~+155℃
R31 = 0603WAF2002T5E: 电阻类型:厚膜电阻;阻值:20kΩ;精度:±1%;功率:100mW;最大工作电压:75V;温度系数:±100ppm/℃;; LCSC Part Name: 20kΩ ±1% 100mW 厚膜电阻; Supplier Part: C4184; Manufacturer: UNI-ROYAL(厚声); Supplier Footprint: 0603; JLCPCB Part Class: Basic Part; Datasheet: https://atta.szlcsc.com/upload/public/pdf/source/20200306/C422600_1E6D84923E4A46A82E41ADD87F860B5C.pdf; Supplier: LCSC; Type: 厚膜电阻; Tolerance: ±1%; Power(Watts): 100mW; Overload Voltage (Max): 75V; Temperature Coefficient: ±100ppm/℃; Operating Temperature Range: -55℃~+155℃
U8 U9 = XR0630-100M: 电感值:10uH;精度:±20%;; LCSC Part Name: 10uH ±20%; Supplier Part: C5307622; Manufacturer: XR(祥如); Supplier Footprint: SMD,0630; JLCPCB Part Class: Extended Part; Datasheet: https://atta.szlcsc.com/upload/public/pdf/source/20221228/8F25018F537F239E81AF9D59F9CE91EF.pdf; Supplier: LCSC; Tolerance: ±20%
U10 = MT3608: 功能类型:升压型;输入电压:2V~24V;输出电压:28V;输出电流(最大值):-;; LCSC Part Name: 升压型 输入2V~24V 输出28V; Supplier Part: C84817; Manufacturer: 西安航天民芯; Supplier Footprint: SOT-23-6; JLCPCB Part Class: 扩展库; Datasheet: https://atta.szlcsc.com/upload/public/pdf/source/20161110/1478743351706.pdf; Supplier: LCSC; Function: 升压型; Number of Outputs: 1; Topology: 升压式; Input Voltage: 2V~24V; Output Voltage: 28V; Switching Frequency: 1.2MHz
U11 = PT6315-LQ: Supplier Part: C2889064; Supplier Footprint: LQFP-44(10x10); JLCPCB Part Class: Extended Part; Datasheet: https://atta.szlcsc.com/upload/public/pdf/source/20210825/C2889064_6BC8EEF4471B3E440964505DC05D51B8.pdf; Supplier: LCSC
U12 = LM321MF_C4369753: Supplier Part: C4369753; Manufacturer: TI(德州仪器); Supplier Footprint: SOT-23-5; JLCPCB Part Class: 扩展库; Datasheet: https://atta.szlcsc.com/upload/public/pdf/source/20230222/2892833FA409AEDF4881A31199C81371.pdf; Supplier: LCSC
U13 = TC118S: 单通道直流马达驱动器; Supplier Part: C88308; Manufacturer: FM(富满); Supplier Footprint: SOP-8; JLCPCB Part Class: 扩展库; Datasheet: https://atta.szlcsc.com/upload/public/pdf/source/20220412/826ADF4DB73FF5AE6DBE5D5A86BC6FF7.pdf; Supplier: LCSC
U14 = 7-BT-317NK: VFD-双叶7-BT-317NK; Check: false

## Nets
3V3: BOOT0.2 BUZZER1.1 C47.2 C48.2 C49.2 C50.2 C51.2 C52.2 C56.2 C66.1 C74.1 H1.4 R19.2 R33.1 R34.2 R35.2 R43.1 U6.1(VBAT) U6.9(VDDA) U6.24(VDD_1) U6.36(VDD_2) U6.48(VDD_3) U7.2(VOUT) U16.2(VCC)
5V: C45.2 C46.2 C63.2 R39.2 R40.2 R41.2 R42.2 SW5.3 SW5.4 U7.3(VIN) U13.4(VDD) U23.2(S) U24.2(S) U25.2(S) U26.1
GND: C45.1 C46.1 C47.1 C48.1 C49.1 C50.1 C51.1 C52.1 C53.2 C54.2 C55.1 C56.1 C58.1 C60.1 C61.1 C63.1 C65.1 C66.2 C67.1 C68.1 C69.1 C70.1 C71.2 C72.2 C73.2 C74.2 C75.1 C77.1 C78.1 D1.1(K) H1.3 H2.3 LED1.1(GND/VSS) LED2.1(GND/VSS) LED3.1(GND/VSS) Q2.2(S) Q3.2(E) R16.1 R17.1 R20.1 R21.1 R23.1 R25.1 R31.1 R37.1 R38.1 RST0.1 SW1.1 SW1.3(GND) SW2.1 SW2.3(GND) SW5.6 SW5.7 U6.8(VSSA) U6.23(VSS_1) U6.35(VSS_2) U6.47(VSS_3) U7.1(VSS) U10.2(GND) U11.12(VSS) U11.44(VSS) U12.1(IN+) U12.2(V-) U13.6(AGND) U13.7(PGND) U15.13(EH) U15.A1(GND) U15.A12(GND) U15.B1(GND) U15.B12(GND) U16.5(GND) U17.7(GND) U17.9(EP) U18.4(GND) U26.3 U27.1(VSS) VBAT-.1 X3.2(GND) X3.4(GND)
VBAT: C67.2 C68.2 L1.1 R36.2 U17.6(BAT) VBAT+.1
VBAT_LOW: C65.2 U16.6(VBAT) U22.1
VBUS: C69.2 C70.2 SW5.5 U15.A4(VBUS) U15.A9(VBUS) U15.B4(VBUS) U15.B9(VBUS) U17.5(VCC)
32K: U6.3(PC14-OSC32_IN) U16.1(32kHz)
B1: SW1.2 U6.10(PA0-WKUP)
B2: SW2.2 U6.25(PB12)
BAT-5V: C71.1 C72.1 C73.1 D3.1(K) SW5.1 U17.1(VOUT)
BAT_CHRG: U6.40(PB4) U17.2(CHRG#)
BAT_FULL: U6.39(PB3) U17.4(STDBY#)
BAT_VOL_DET: R36.1 R37.2 U6.11(PA1)
BOOT0: BOOT0.1 R20.2 U6.44(BOOT0)
BOOT1: R21.2 U6.20(PB2)
BUZZER: Q3.1(B) U6.12(PA2)
CLK: U6.15(PA5) U11.8(CLK)
DHT11: U6.28(PB15) U18.2(DATA)
DHT11_POWER: R40.1 U6.22(PB11) U24.1(G)
DIN: U6.17(PA7) U11.7(DIN)
DS_IRQ: R33.2 U6.41(PB5) U16.3(INT#/SQW)
DS_RST: U6.45(PB8) U16.4(RST#)
F1: C62.2 R30.2 U14.1(F+) U14.2(F+)
F2: C64.2 R32.1 U14.31(F-) U14.32(F-)
G1: U11.42(GR1) U14.30(1G)
G2: U11.41(GR2) U14.8(2G)
G3: U11.40(GR3) U14.11(3G)
G4: U11.39(GR4) U14.15(4G)
G5: U11.38(SG24/GR5) U14.19(5G)
G6: U11.37(SG23/GR6) U14.23(6G)
G7: U11.36(SG22/GR7) U14.26(7G)
ITR_RX: R42.1 U6.19(PB1) U26.4
ITR_TX: U6.26(PB13) U26.2
OSC_IN: C53.1 U6.5(PD0-OSC_IN) X3.1(OSC1)
OSC_OUT: C54.1 U6.6(PD1-OSC_OUT) X3.3(OSC2)
P1: U11.14(SG1/KS1) U14.3(P1)
P2: U11.15(SG2/KS2) U14.4(P2)
P3: U11.16(SG3/KS3) U14.5(P3)
P4: U11.17(SG4/KS4) U14.6(P4)
P5: U11.18(SG5/KS5) U14.7(P5)
P6: U11.19(SG6/KS6) U14.9(P6)
P7: U11.20(SG7/KS7) U14.10(P7)
P8: U11.21(SG8/KS8) U14.12(P8)
P9: U11.22(SG9/KS9) U14.13(P9)
P10: U11.23(SG10/KS10) U14.14(P10)
P11: U11.24(SG11/KS11) U14.16(P11)
P12: U11.25(SG12/KS12) U14.17(P12)
P13: U11.26(SG13/KS13) U14.18(P13)
P14: U11.27(SG14/KS14) U14.20(P14)
P15: U11.28(SG15/KS15) U14.21(P15)
P16: U11.29(SG16/KS16) U14.22(P16)
P17: U11.31(SG17/GR12) U14.24(P17)
P18: U11.32(SG18/GR11) U14.25(P18)
P19: U11.33(SG19/GR10) U14.27(P19)
P20: U11.34(SG20/GR9) U14.28(P20)
P21: U11.35(SG21/GR8) U14.29(P21)
REST: C55.2 R19.1 RST0.2 U6.7(NRST)
SCL: R34.1 U6.42(PB6) U16.8(SCL)
SDA: R35.1 U6.43(PB7) U16.7(SDA)
STB: U6.14(PA4) U11.9(STB)
STM32_USB_DN: U6.32(PA11) U15.A7(D-) U15.B7(D-)
STM32_USB_DP: R43.2 U6.33(PA12) U15.A6(D+) U15.B6(D+)
SWCLK: H1.2 U6.37(PA14)
SWDIO: H1.1 U6.34(PA13)
UART1_RX: H2.2 U6.31(PA10)
UART1_TX: H2.1 U6.30(PA9)
VFD-3V3: C61.2 C78.2 U11.13(VDD) U11.43(VDD) U27.2(VOUT)
VFD-5V: C58.2 C60.2 C77.2 R28.2 R29.2 U8.1 U10.4(EN) U10.5(IN) U12.5(V+) U23.3(D) U27.3(VIN)
VFD-PWM: Q2.1(G) R28.1 U6.29(PA8) U13.2(INA)
VFD_POWER: R39.1 U6.21(PB10) U23.1(G)
VH: C75.2 D2.2(A) R22.2 U9.2 U11.30(VEE)
WS2812: LED1.2(DIN) U6.18(PB0)
WS2812-5V: LED1.3(VCC/VDD) LED2.3(VCC/VDD) LED3.3(VCC/VDD) U25.3(D)
WS2812_POWER: R41.1 U6.13(PA3) U25.1(G)
$1N1253: R25.2 U11.5(OSC)
$1N1296: C57.2 U8.2 U10.1(SW)
$1N1297: C57.1 D1.2(A) U9.1
$1N1299: R24.2 U10.3(FB)
$1N1300: R26.2 R27.1 U12.3(IN-)
$1N1301: R24.1 R26.1 U12.4(OUT)
$1N1303: R22.1 R23.2 R27.2
$1N1312: D2.1(C) R30.1 R31.2 R32.2
$1N1318: C62.1 U13.8(OUTA)
$1N1319: C64.1 U13.5(OUTB)
$1N1408: Q2.3(D) R29.1 U13.3(INB)
$2N2590: BUZZER1.2 Q3.3(C)
$2N4036: LED1.4(DOUT) LED2.2(DIN)
$2N4043: LED2.4(DOUT) LED3.2(DIN)
$2N10742: U18.1(VDD) U24.3(D)
$3N719: R17.2 U15.A5(CC1)
$3N723: R16.2 U15.B5(CC2)
$3N920: R38.2 U17.3(PROG)
$3N1362: D3.2(A) L1.2 U17.8(LX)

Not connected (* = marked no-connect by the designer): LED3 4(DOUT)*; U6 2(PC13-TAMPER-RTC)* 4(PC15-OSC32_OUT)* 16(PA6)* 27(PB14)* 38(PA15)* 46(PB9)*; U10 6(NC)*; U11 1(LED1)* 2(LED2)* 3(LED3)* 4(LED4)* 6(DOUT)* 10(K1)* 11(K2)*; U13 1(NC)*; U15 A8(SBU1)* B8(SBU2)*; U18 3(NC)*; U21 1*

## Notes on the sheets
sheet 1
- -25V
